# EAGLE design controller16 (EAGLE 9.4.2)

## Sheet 1 of 2
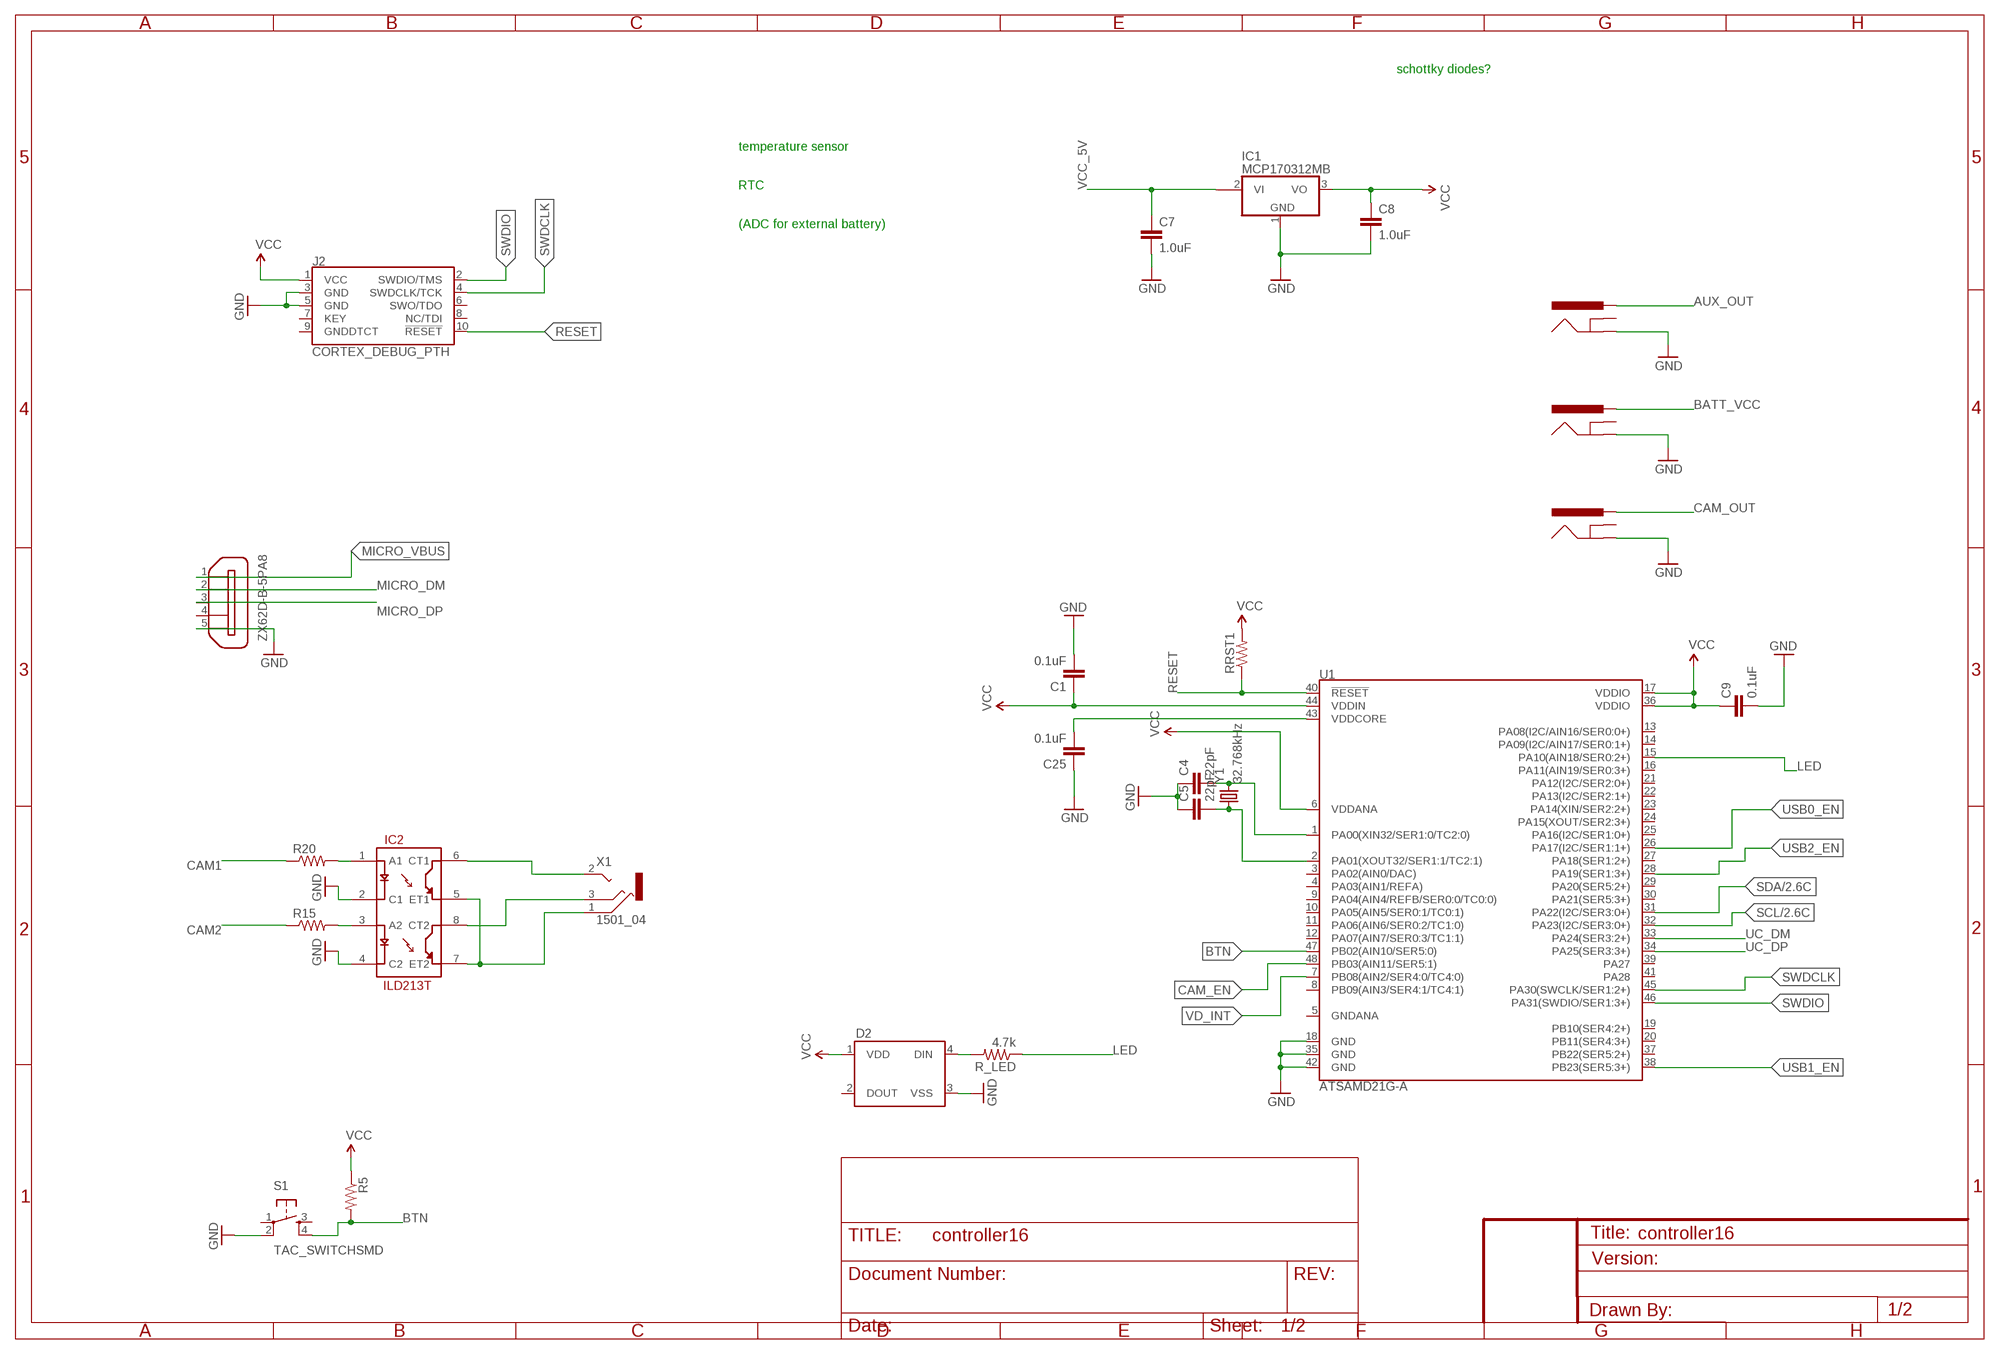
[diagram p0: schematic, sheet 1]

### Parts
C1  0.1uF  1.0UF-0805-25V-10%  [0805]
C4  22pF  CAP0805  [0805]
C5  22pF  CAP0805  [0805]
C7  1.0uF  1.0UF-1206-50V-10%  [1206]
C8  1.0uF  1.0UF-1206-50V-10%  [1206]
C9  0.1uF  1.0UF-0805-25V-10%  [0805]
C25  0.1uF  1.0UF-0805-25V-10%  [0805]
D2  WS2812B  [WS2812B]
IC1  MCP170312MB  [SOT89]
IC2  ILD213T  [SO08]
J1  POWER_JACKPTH_BREAD  [POWER_JACK_PTH_BREAD]
J2  CORTEX_DEBUG_PTH  [2X5-PTH-1.27MM]
J3  POWER_JACKPTH_BREAD  [POWER_JACK_PTH_BREAD]
J4  POWER_JACKPTH_BREAD  [POWER_JACK_PTH_BREAD]
R5  RESISTOR0805-RES  [0805]
R15  RESISTOR0805-RES  [0805]
R20  RESISTOR0805-RES  [0805]
R_LED  4.7k  RESISTOR0805-RES  [0805]
RRST1  RESISTOR0805-RES  [0805]
S1  TAC_SWITCHSMD  [TACTILE-SWITCH-SMD]
U1  ATSAMD21G-A  [TQFP-48]
X1  1501_04  [1501_05]
X2  ZX62D-B-5PA8  [ZX62D-B-5PA8]
Y1  32.768kHz  CRYSTAL3.2X1.5MM  [CRYSTAL-SMD-3.2X1.5MM]

### Nets
AUX_OUT [hub_power]: J1.PWR ; also sheet 2
BATT_VCC [hub_power]: J4.PWR ; also sheet 2
BTN: R5.2 S1.4 U1.47(PB02(AIN10/SER5:0))
CAM1: R20.1
CAM2: R15.1
CAM_EN: U1.48(PB03(AIN11/SER5:1)) ; also sheet 2
CAM_OUT: J3.PWR ; also sheet 2
GND: C1.2 C4.1 C5.1 C7.2 C8.2 C9.2 C25.1 D2.3(VSS) IC1.1(GND) IC2.2(C1) IC2.4(C2) J1.GND J2.3(GND) J2.5(GND) J3.GND J4.GND S1.2 U1.18(GND) U1.35(GND) U1.42(GND) X2.5 ; also sheet 2
LED: R_LED.1 U1.15(PA10(AIN18/SER0:2+))
MICRO_DM: X2.2
MICRO_DP: X2.3
MICRO_VBUS: X2.1
N$5: C25.2 U1.43(VDDCORE)
N$7: D2.4(DIN) R_LED.2
N$8: C4.2 U1.1(PA00(XIN32/SER1:0/TC2:0)) Y1.P$2
N$12: IC2.6(CT1) X1.2
N$13: IC2.8(CT2) X1.3
N$15: IC2.3(A2) R15.2
N$19: IC2.1(A1) R20.2
N$32: C5.2 U1.2(PA01(XOUT32/SER1:1/TC2:1)) Y1.P$1
N$34: IC2.5(ET1) IC2.7(ET2) X1.1
RESET: J2.10(!RESET) RRST1.1 U1.40(!RESET!)
SCL: U1.32(PA23(I2C/SER3:0+)) ; also sheet 2
SDA: U1.31(PA22(I2C/SER3:0+)) ; also sheet 2
SWDCLK: J2.4(SWDCLK/TCK) U1.45(PA30(SWCLK/SER1:2+))
SWDIO: J2.2(SWDIO/TMS) U1.46(PA31(SWDIO/SER1:3+))
UC_DM: U1.33(PA24(SER3:2+))
UC_DP: U1.34(PA25(SER3:3+))
USB0_EN: U1.26(PA17(I2C/SER1:1+))
USB1_EN: U1.38(PB23(SER5:3+))
USB2_EN: U1.28(PA19(SER1:3+))
VCC [power]: C1.1 C8.1 C9.1 D2.1(VDD) IC1.3(VO) J2.1(VCC) R5.1 RRST1.2 U1.6(VDDANA) U1.17(VDDIO) U1.36(VDDIO) U1.44(VDDIN) ; also sheet 2
VCC_5V [power]: C7.1 IC1.2@1(VI1)
VD_INT: U1.7(PB08(AIN2/SER4:0/TC4:0)) ; also sheet 2
Unconnected: D2.2(DOUT) IC1.2(VI) J1.GNDBREAK J2.6(SWO/TDO) J2.7(KEY) J2.8(NC/TDI) J2.9(GNDDTCT) J3.GNDBREAK J4.GNDBREAK S1.1 S1.3 U1.3(PA02(AIN0/DAC)) U1.4(PA03(AIN1/REFA)) U1.5(GNDANA) U1.8(PB09(AIN3/SER4:1/TC4:1)) U1.9(PA04(AIN4/REFB/SER0:0/TC0:0)) U1.10(PA05(AIN5/SER0:1/TC0:1)) U1.11(PA06(AIN6/SER0:2/TC1:0)) U1.12(PA07(AIN7/SER0:3/TC1:1)) U1.13(PA08(I2C/AIN16/SER0:0+)) U1.14(PA09(I2C/AIN17/SER0:1+)) U1.16(PA11(AIN19/SER0:3+)) U1.19(PB10(SER4:2+)) U1.20(PB11(SER4:3+)) U1.21(PA12(I2C/SER2:0+)) U1.22(PA13(I2C/SER2:1+)) U1.23(PA14(XIN/SER2:2+)) U1.24(PA15(XOUT/SER2:3+)) U1.25(PA16(I2C/SER1:0+)) U1.27(PA18(SER1:2+)) U1.29(PA20(SER5:2+)) U1.30(PA21(SER5:3+)) U1.37(PB22(SER5:2+)) U1.39(PA27) U1.41(PA28) X2.4 X2.S1 X2.S2 X2.S3 X2.S4

### Notes on the sheet
- schottky diodes?
- temperature sensor
- RTC
- (ADC for external battery)

## Sheet 2 of 2
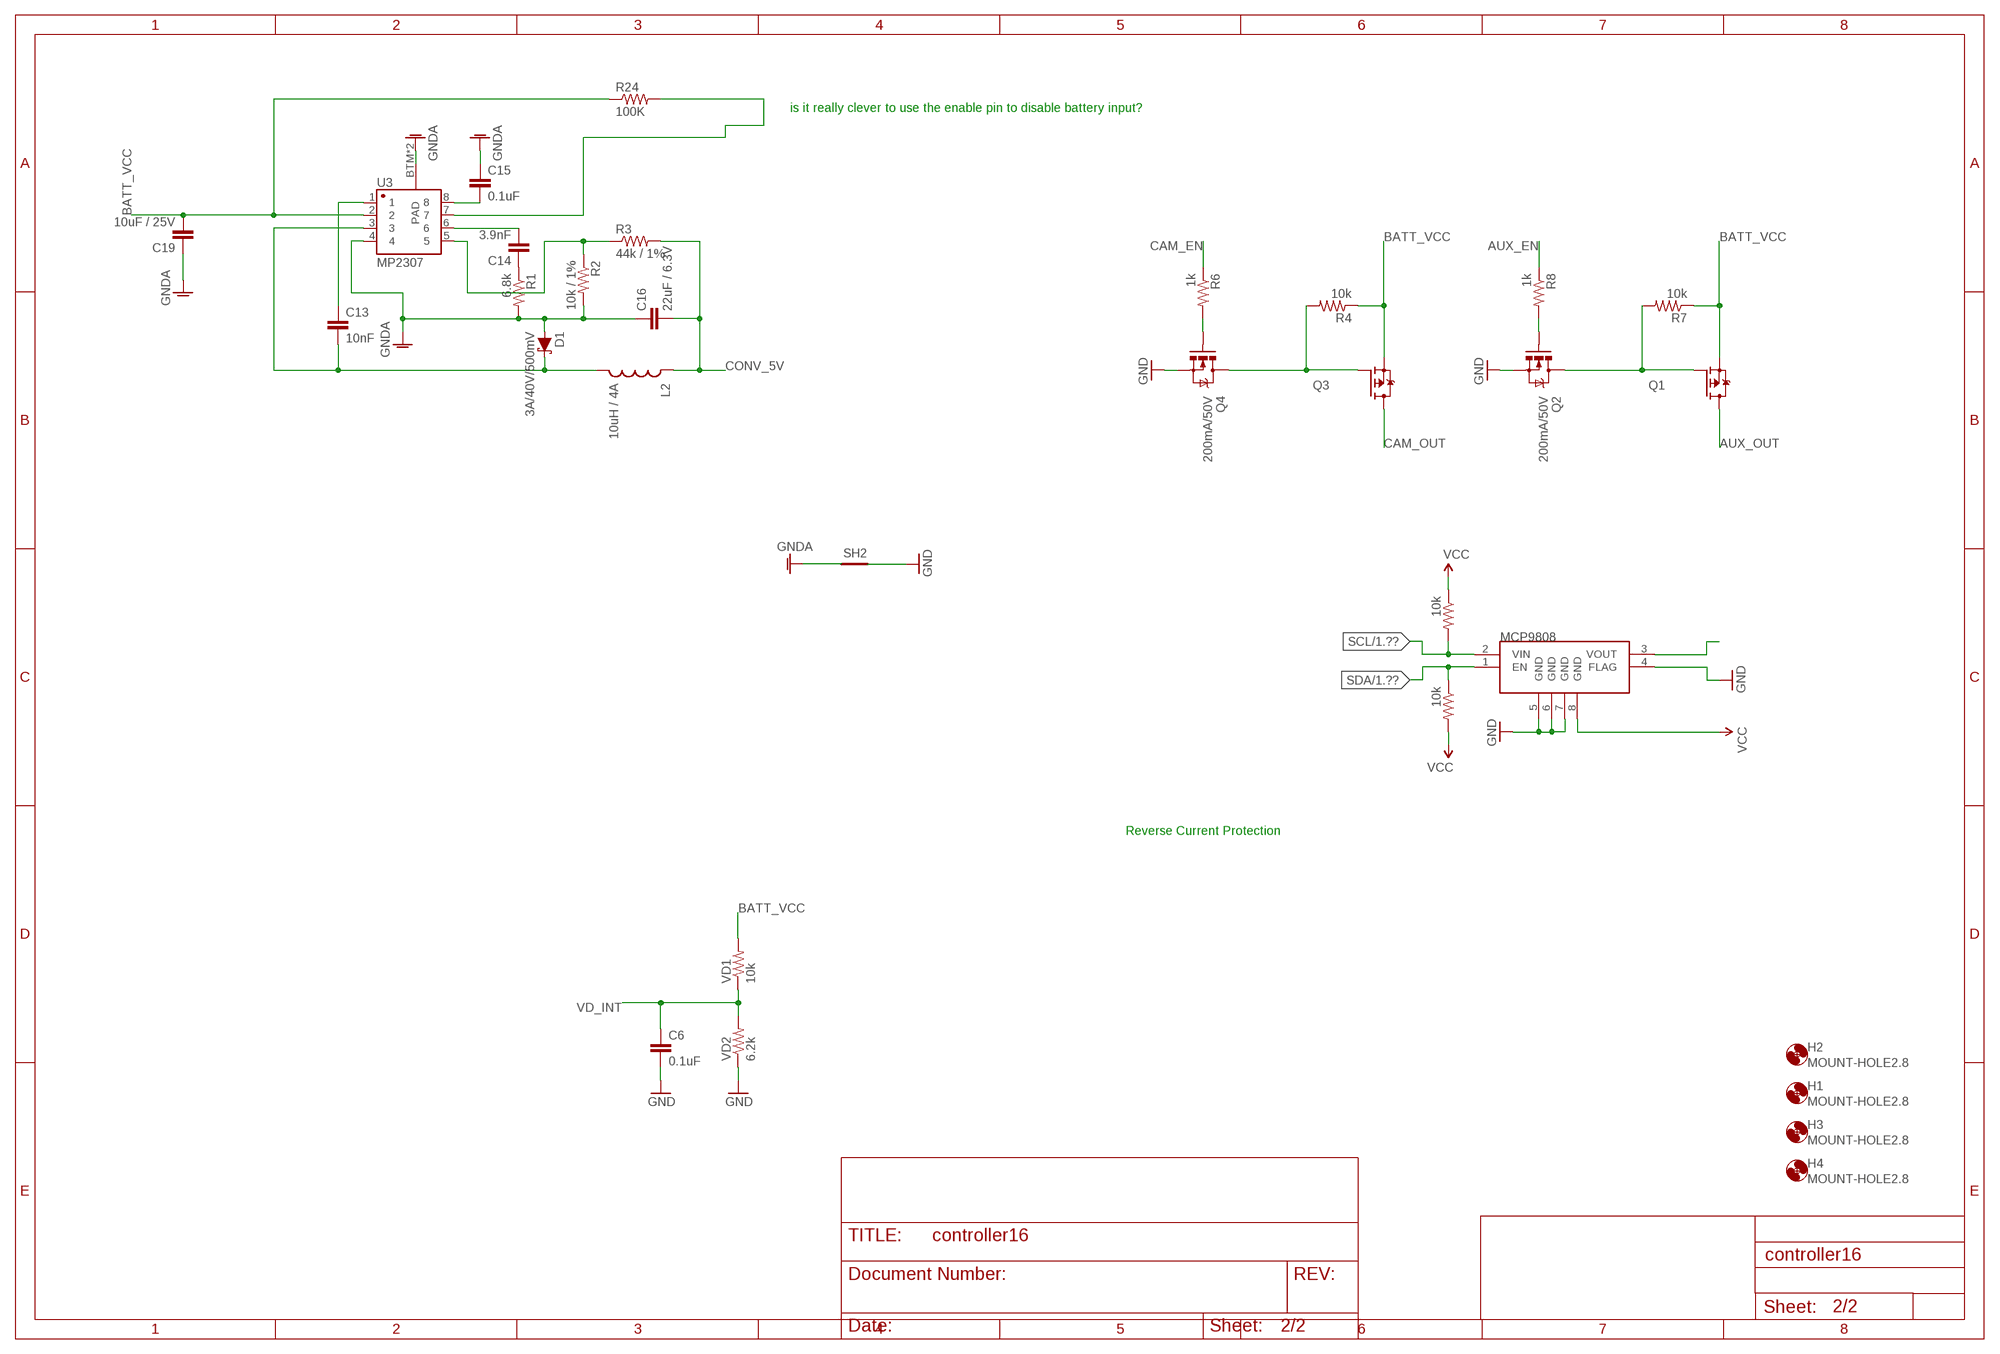
[diagram p1: schematic, sheet 2]

### Parts
C6  0.1uF  CAP1206  [1206]
C13  10nF  CAP0805  [0805]
C14  3.9nF  CAP1206  [1206]
C15  0.1uF  CAP1206  [1206]
C16  22uF / 6.3V  CAP1210  [1210]
C19  10uF / 25V  CAP1210  [1210]
D1  3A/40V/500mV  DIODE-SCHOTTKY-B340A  [SMA-DIODE]
H1  MOUNT-HOLE2.8  [2,8]
H2  MOUNT-HOLE2.8  [2,8]
H3  MOUNT-HOLE2.8  [2,8]
H4  MOUNT-HOLE2.8  [2,8]
L2  10uH / 4A  INDUCTORSRU1038  [SRU1038]
MCP9808  V_REG_MIC5216  [MSOP8]
Q1  FDD4141TO252  [TO252]
Q2  200mA/50V  MOSFET-NCHANNELBSS138  [SOT23-3]
Q3  FDD4141TO252  [TO252]
Q4  200mA/50V  MOSFET-NCHANNELBSS138  [SOT23-3]
R1  6.8k  RESISTOR1206  [1206]
R2  10k / 1%  RESISTOR1206  [1206]
R3  44k / 1%  RESISTOR1206  [1206]
R4  10k  RESISTOR0805-RES  [0805]
R6  1k  RESISTOR0805-RES  [0805]
R7  10k  RESISTOR0805-RES  [0805]
R8  1k  RESISTOR0805-RES  [0805]
R24  100K  RESISTOR1206  [1206]
R_I2C_1  10k  RESISTOR0805-RES  [0805]
R_I2C_2  10k  RESISTOR0805-RES  [0805]
SH2  SHORT-HT5  [SHORT_TOP-50]
U3  MP2307  GENERIC-SOIC8MSGEQ7N-FILTER  [SO08]
VD1  10k  RESISTOR1206  [1206]
VD2  6.2k  RESISTOR1206  [1206]

### Nets
AUX_EN: R8.1
AUX_OUT [hub_power]: Q1.3(D) ; also sheet 1
BATT_VCC [hub_power]: C19.2 Q1.2(S) Q3.2(S) R4.1 R7.1 R24.1 U3.2 VD1.2 ; also sheet 1
CAM_EN: R6.1 ; also sheet 1
CAM_OUT: Q3.3(D) ; also sheet 1
CONV_5V [power]: C16.2 L2.1 R3.2
GND: C6.2 MCP9808.4(FLAG) MCP9808.5(GND) MCP9808.6(GND) MCP9808.7(GND) Q2.2(S) Q4.2(S) SH2.2 VD2.1 ; also sheet 1
GNDA [power]: C15.1 C16.1 C19.1 D1.A R1.2 R2.2 SH2.1 U3.4 U3.BTM(PAD) U3.P$1(PAD)
N$1: Q1.1(G) Q2.3(D) R7.2
N$2: Q4.1(G) R6.2
N$3: Q3.1(G) Q4.3(D) R4.2
N$4: MCP9808.3(VOUT)
N$6: Q2.1(G) R8.2
N$25: C15.2 U3.8
N$26 [power]: C13.2 D1.C L2.2 U3.3
N$27: C13.1 U3.1
N$28: C14.1 R1.1
N$29: C14.2 U3.6
N$30: R2.1 R3.1 U3.5
PB_BUCK_EN: R24.2 U3.7
SCL: MCP9808.2(VIN) R_I2C_1.2 ; also sheet 1
SDA: MCP9808.1(EN) R_I2C_2.1 ; also sheet 1
VCC [power]: MCP9808.8(GND) R_I2C_1.1 R_I2C_2.2 ; also sheet 1
VD_INT: C6.1 VD1.1 VD2.2 ; also sheet 1

### Notes on the sheet
- is it really clever to use the enable pin to disable battery input?
- Reverse Current Protection

## Library data of the parts
C1 C9 C25 = SparkFun-Capacitors:1.0UF: 1µF ceramic capacitors A capacitor is a passive two-terminal electrical component used to store electrical energy temporarily in an electric field.; PROD_ID: CAP-08064; VALUE: 1.0uF
C4 C5 = SparkFun-Passives:CAP: Capacitor Standard 0603 ceramic capacitor, and 0.1" leaded capacitor.
C6 C13-C16 C19 = SparkFun-Capacitors:CAP: Capacitor Standard 0603 ceramic capacitor, and 0.1" leaded capacitor.
C7 C8 = SparkFun-Capacitors:1.0UF: 1µF ceramic capacitors A capacitor is a passive two-terminal electrical component used to store electrical energy temporarily in an electric field.; PROD_ID: CAP-09822
D1 = SparkFun-DiscreteSemi:DIODE-SCHOTTKY: Schottky diode A Schottky diode is a semiconductor diode which has a low forward voltage drop and a very fast switching action.; PROD_ID: DIO-09886
D2 = SparkFun-LED:WS2812B: WS2812B - Intelligent control LED integrated light source Technical Specifications: Power Supply Voltage (VDD): 3.5 to 5.3 V Input Voltage (VI): -0.5 to VDD+0.5 V Operating Junction Temperature (Topt): -25°C to +80°C Storage Temperature Range (Tstg): -55°C to +150°C; PROD_ID: DIO-12503
H1-H4 = holes:MOUNT-HOLE: MOUNTING HOLE with drill center marker
IC1 = linear:MCP1703*: 250 mA, 16V, Low Quiescent Current LDO Regulator Source: http://ww1.microchip.com/downloads/en/DeviceDoc/22049b.pdf
IC2 = SparkFun-DiscreteSemi:ILD213T: Dual optoisolator.
J1 J3 J4 = SparkFun-Connectors:POWER_JACK: Power Jack Connector This is the standard 5.5mm barrel jack for power. The PTH is the most common, proven, reliable, footprint. The Slot footprint only works if the mill layer is transmitted to the PCB fab house so be warned. Here are the connectors we sell at SparkFun: DC Barrel Power Jack/Connector <https://www.sparkfun.com/products/119> (PRT-00119) DC Barrel Power Jack/Connector (SMD) <https://www.sparkfun.com/products/12748> (PRT-12748) DC Barrel Jack Adapter - Breadboard Compatible <https://www.sparkfun.com/products/10811> (PRT-10811) It is used on this SparkFun product (and many, many others): SparkFun RedBoard - Programmed with Arduino <https://www.sparkfun.com/products/12757> (DEV-12757) Also, if you need a mating power supply or connector, please check these out: Wall Adapter Power Supply - 9VDC 650mA <https://www.sparkfun.com/products/298> (TOL-00298) DC Barrel Jack Adapter - Male <https://www.sparkfun.com/products/10287> (PRT-10287); PROD_ID: PRT-10811
J2 = SparkFun-Connectors:CORTEX_DEBUG: Cortex Debug Connector - 10 pin Supports JTAG debug, Serial Wire debug, and Serial Wire Viewer. PTH and SMD connector options available. General Connector Information <http://infocenter.arm.com/help/topic/com.arm.doc.faqs/attached/13634/cortex_debug_connectors.pdf> Products: PTH Connector <http://www.digikey.com/product-detail/en/cnc-tech/3220-10-0100-00/1175-1627-ND/3883661> -via Digi-Key SparkFun PSoc <https://www.sparkfun.com/products/13229> SparkFun T <https://www.sparkfun.com/products/13810>
L2 = SparkFun-Passives:INDUCTOR: Inductors Basic Inductor/Choke - 0603 and 1206. Footprints are not proven and vary greatly between part numbers. INDUCTOR POWER 3.3UH 4.0A SMD 0.197" L x 0.197" W x 0.177" H (5.00mm x 5.00mm x 4.50mm)
MCP9808 = SparkFun-IC-Power:V_REG_MIC5216: 500mA LDO, MSOP8 for better dissipation; PROD_ID: IC-09527
Q1 Q3 = transistor-fet:FDD4141: P-Channel PowerTrench® MOSFET Source: FDD4141.pdf
Q2 Q4 = SparkFun-DiscreteSemi:MOSFET-NCHANNEL: Common NMOSFET Parts MFG P/N Store ID Prod ID FDD8780 TRANS-09984 SI7820DN TRANS-11055 FDS6630A IC-08089 2N7002PW TRANS-11151 FQP30N06L COM-10213 TRANS-10060 BSS123LT1G TRANS-08345 BSS138 TRANS-00830 BS170 2N7000; PROD_ID: TRANS-00830
R1-R4 R6-R8 R24 R_LED = SparkFun-Resistors:RESISTOR: Resistor Basic schematic elements and footprints for 0603, 1206, and PTH resistors.
R5 R15 R20 R_I2C_1 R_I2C_2 RRST1 VD1 VD2 = SparkFun-Passives:RESISTOR: Resistor Basic schematic elements and footprints for 0603, 1206, and PTH resistors.
S1 = SparkFun-Retired:TAC_SWITCH: Momentary Switch Button commonly used for reset or general input. Spark Fun Electronics SKU : COM-00097 SMT- SWCH-08247; PROD_ID: SWCH-08247
SH2 = shorts:SHORT-H: Short between two nets; BOM: no
U1 = SparkFun-IC-Microcontroller:ATSAMD21G: Atmel SAMD21G SMART ARM-Based Microcontroller The Atmel ® | SMART ™ SAM D21 is a series of low-power microcontrollers using the 32-bit ARM ® Cortex ® -M0+ processor, and ranging from 32- to 64-pins with up to 256KB Flash and 32KB of SRAM. The SAM D21 devices operate at a maximum frequency of 48MHz and reach 2.46 CoreMark/MHz. They are designed for simple and intuitive migration with identical peripheral modules, hex compatible code, identical linear address map and pin compatible migration paths between all devices in the product series. All devices include intelligent and flexible peripherals, Atmel Event System for inter-peripheral signaling, and support for capacitive touch button, slider and wheel user interfaces. Datasheet <https://cdn.sparkfun.com/datasheets/Dev/Arduino/Boards/Atmel-42181-SAM-D21_Datasheet.pdf> SparkFun Products SparkFun SAMD21 Mini Breakout <https://www.sparkfun.com/products/13664> (DEV-13664) SparkFun SAMD21 Dev Breakout <https://www.sparkfun.com/products/13672> (DEV-13672); PROD_ID: IC-13064
U3 = SparkFun-AnalogIC:GENERIC-SOIC8: A placeholder for generic narrow & wide SOIC8 foorptints - used on the DIP adapter board.; PROD_ID: IC-10141
X1 = con-lumberg:1501_0*: Jack connectors according to JISC 6560, 2.5 mm Klinkensteckverbinder nach JISC 6560, 2,5 mm Source: http://www.lumberg.com/Produkte/PDFs/1501_05.pdfedit 1501_03 http://www.lumberg.com/Produkte/PDFs/1501_06.pdf; OC_FARNELL: 1216977; OC_NEWARK: unknown
X2 = zx62d-b-5pa8-oshpark_10:ZX62D-B-5PA8: Micro USB Type B Connector - Standard, Shell Through Hole Source: http://www.hirose.co.jp/cataloge_hp/ed_ZX_20140804.pdf; MF: Hirose; MPN: ZX62D-B-5PA8; OC_FARNELL: 2300438; OC_NEWARK: 69W0712
Y1 = SparkFun-FreqCtrl:CRYSTAL: Various standard crystals. Proven footprints.; PROD_ID: XTAL-13062

## Net classes
0 default: width 0.254 mm, clearance 0.152 mm
1 power: width 0.254 mm, clearance 0.254 mm
2 hub_power: width 0.584 mm, clearance 0.254 mm
3 usbsignal: width 0.254 mm, clearance 0.203 mm
4 highpower: clearance 0.305 mm

## Board
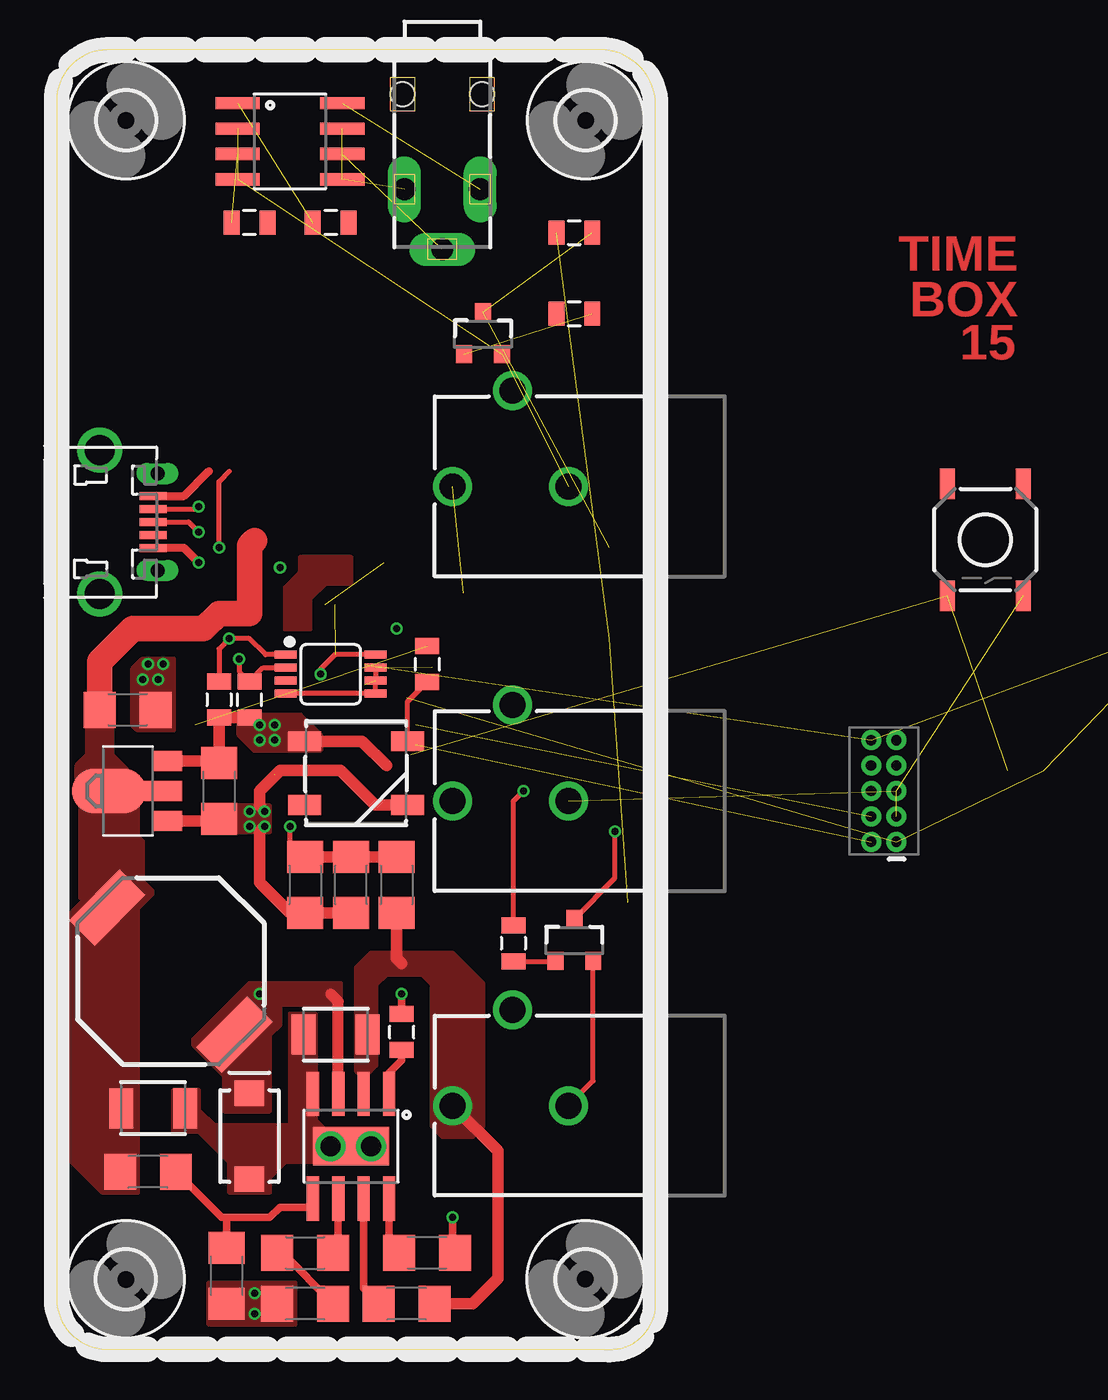
[diagram p2: board, top side]
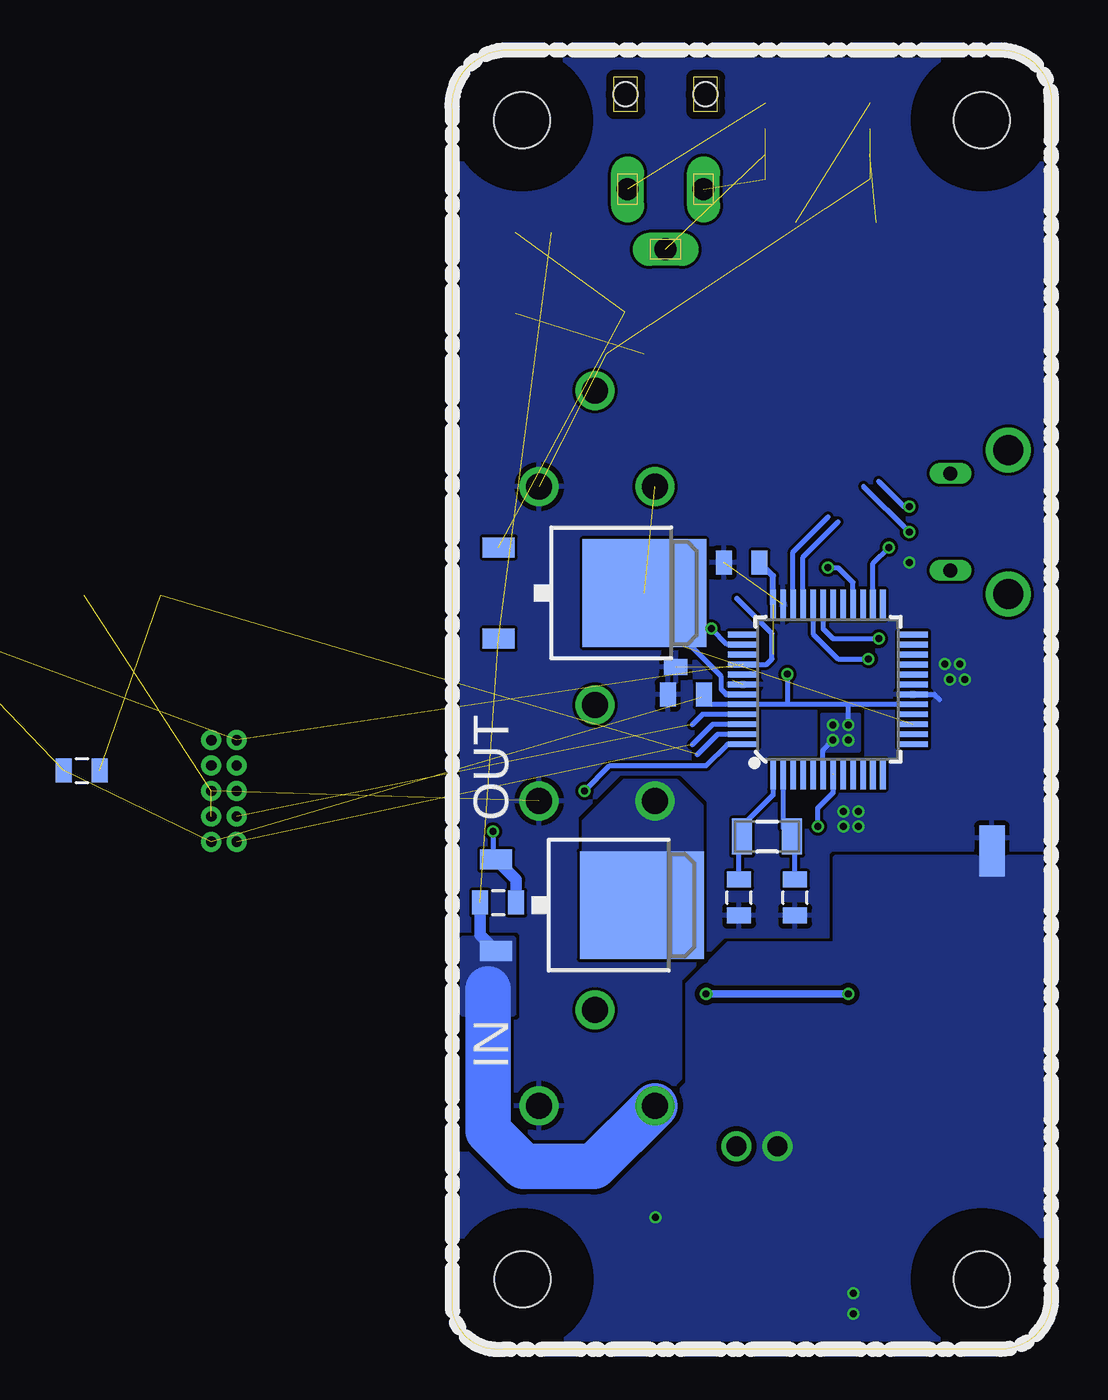
[diagram p3: board, bottom side, seen from below]

Size 29.98 x 65.04 mm. Coordinates in mm from the lower left corner, seen from the top.
Outline: 0,2.55 arc90 2.54,0.01 27.43,0.01 arc90 29.97,2.05 29.97,61.99 arc90 27.43,65.04 2.54,65.04 arc90 0,62.5 0,2.55
Copper layers (1*16): Top 0.035559375mm / dielectric 1.6mm / Bottom 0.035559375mm
Design rules "oshpark-2layer": minimum track width 6mil, minimum drill 10mil, track to track 6mil, track to pad 6mil, pad to pad 6mil, via to via 6mil, smd to smd 6mil, copper to edge 15mil, drill to drill 6mil, minimum pad ring 5mil, minimum via ring 5mil, stop-mask expansion 2.5mil, vias tented up to drill 0mil, thermal gap 10mil

### Footprints (pad centres in the part's own frame; a part is rotated, then mirrored left to right if it is on the bottom)
0805 = smd 0.8 x 1.2: 1 -0.9,0; 2 0.9,0
1206 = smd 1.6 x 1.8: 1 -1.4,0; 2 1.4,0
1210 = smd 1.2 x 2: 1 -1.6,0; 2 1.6,0
SMA-DIODE = smd 1.27 x 1.47: A -2.15,0; C 2.15,0
WS2812B = smd 1.651 x 1: 1 -2.577,1.6; 2 -2.577,-1.6; 3 2.577,-1.6; 4 2.577,1.6
2,8 = hole 2.8: 0,0
SOT89 = smd 1 x 1.5: 1 -1.499,-1.981; 3 1.499,-1.981 | smd 1 x 2: 2 0,-1.727 | smd 2.2 x 3.7: 2@1 0,0.94
SO08 = smd 0.61 x 2.21: 1 -1.905,-2.616; 2 -0.635,-2.616; 3 0.635,-2.616; 4 1.905,-2.616; 5 1.905,2.616; 6 0.635,2.616; 7 -0.635,2.616; 8 -1.905,2.616
POWER_JACK_PTH_BREAD = drill 1.3: GND 0,7.9; GNDBREAK 4.8,10.7; PWR 0,13.7
2X5-PTH-1.27MM = drill 0.508 pad 1: 1 -2.54,-0.635; 2 -2.54,0.635; 3 -1.27,-0.635; 4 -1.27,0.635; 5 0,-0.635; 6 0,0.635; 7 1.27,-0.635; 8 1.27,0.635; 9 2.54,-0.635; 10 2.54,0.635
SRU1038 = smd 1.8 x 3.6: 1 -4.5,0; 2 4.5,0
MSOP8 = smd 0.4 x 1.1: 1 -0.975,-2.25; 2 -0.325,-2.25; 3 0.325,-2.25; 4 0.975,-2.25; 5 0.975,2.25; 6 0.325,2.25; 7 -0.325,2.25; 8 -0.975,2.25
TO252 = smd 1 x 1.6: 1 -2.28,-4.8; 2 2.28,-4.8 | smd 5.4 x 6.2: 3 0,2.5
SOT23-3 = smd 0.8 x 0.9: 1 -0.95,-1; 2 0.95,-1; 3 0,1.1
TACTILE-SWITCH-SMD = smd 1.524 x 0.762: 1 -2.794,1.905; 2 2.794,1.905; 3 -2.794,-1.905; 4 2.794,-1.905
SHORT_TOP-50 = smd 1.27 x 1.27: 1 0.635,0; 2 -0.635,0
TQFP-48 = smd 1.5 x 0.28: 1 -4.25,2.75; 2 -4.25,2.25; 3 -4.25,1.75; 4 -4.25,1.25; 5 -4.25,0.75; 6 -4.25,0.25; 7 -4.25,-0.25; 8 -4.25,-0.75; 9 -4.25,-1.25; 10 -4.25,-1.75; 11 -4.25,-2.25; 12 -4.25,-2.75; 25 4.25,-2.75; 26 4.25,-2.25; 27 4.25,-1.75; 28 4.25,-1.25; 29 4.25,-0.75; 30 4.25,-0.25; 31 4.25,0.25; 32 4.25,0.75; 33 4.25,1.25; 34 4.25,1.75; 35 4.25,2.25; 36 4.25,2.75 | smd 0.28 x 1.5: 13 -2.75,-4.25; 14 -2.25,-4.25; 15 -1.75,-4.25; 16 -1.25,-4.25; 17 -0.75,-4.25; 18 -0.25,-4.25; 19 0.25,-4.25; 20 0.75,-4.25; 21 1.25,-4.25; 22 1.75,-4.25; 23 2.25,-4.25; 24 2.75,-4.25; 37 2.75,4.25; 38 2.25,4.25; 39 1.75,4.25; 40 1.25,4.25; 41 0.75,4.25; 42 0.25,4.25; 43 -0.25,4.25; 44 -0.75,4.25; 45 -1.25,4.25; 46 -1.75,4.25; 47 -2.25,4.25; 48 -2.75,4.25
SO08' = smd 0.61 x 2.21: 1 -1.905,-2.616; 2 -0.635,-2.616; 3 0.635,-2.616; 4 1.905,-2.616; 5 1.905,2.616; 6 0.635,2.616; 7 -0.635,2.616; 8 -1.905,2.616 | smd 3.81 x 1.93: BTM 0,0 | drill 1: P$1 1.016,0; P$2 -1.016,0
1501_05 = drill 1.1 pad 1.4 long: 1 -1.9,-8.5; 2 0,-11.5; 3 1.9,-8.5 | hole 1.2: -2,-3.75; 2,-3.75
ZX62D-B-5PA8 = smd 1.35 x 0.4: 1 4.825,1.3; 2 4.825,0.65; 3 4.825,0; 4 4.825,-0.65; 5 4.825,-1.3 | drill 1.5: S1 2.15,-3.6; S2 2.15,3.6 | drill 0.7 long: S3 5.05,2.425; S4 5.05,-2.425
CRYSTAL-SMD-3.2X1.5MM = smd 1 x 1.8: P$1 -1.25,0; P$2 1.25,0

### Placement (x,y rotation side)
C1  18.29,32.78 180 bottom
C4  15.62,22.62 90 bottom
C5  12.83,22.62 90 bottom
C6  12.45,23.25 270 top
C7  3.56,32.02 0 top
C8  8.13,27.95 270 top
C9  15.49,39.38 180 bottom
C13  17.27,15.89 90 top
C14  12.45,4.84 0 top
C15  18.54,4.84 180 top
C16  4.83,12.08 180 top
C19  13.97,15.76 0 top
C25  18.8,35.07 90 bottom
D1  9.65,10.68 90 top
D2  14.99,28.84 0 top
H1  26.47,3.52 0 top
H2  26.48,61.52 0 top
H3  3.47,3.51 0 top
H4  3.47,61.51 0 top
IC1  3.56,27.95 90 top
IC2  11.68,60.47 270 top
J1  33.53,43.19 90 top
J2  41.4,27.95 90 top  (outside the outline)
J3  33.53,27.45 90 top
J4  33.53,12.21 90 top
L2  5.71,18.94 315 top
MCP9808  13.72,33.8 270 top
Q1  22.86,37.86 270 bottom
Q2  21.34,50.81 0 top
Q3  22.99,22.24 270 bottom
Q4  25.91,20.46 0 top
R1  12.45,2.3 180 top
R2  8.51,3.7 270 top
R3  4.57,8.9 180 top
R4  27.69,22.37 0 bottom
R5  48.51,28.97 0 bottom  (outside the outline)
R6  22.86,20.33 270 top
R7  25.91,55.89 0 top
R8  25.91,51.83 0 top
R15  9.65,56.4 180 top
R20  13.72,56.4 180 top
R24  17.53,2.3 180 top
R_I2C_1  9.65,32.53 90 top
R_I2C_2  8.13,32.53 270 top
R_LED  18.54,34.3 270 top
RRST1  54.61,35.32 180 bottom  (outside the outline)
S1  46.48,40.53 270 top  (outside the outline)
SH2  2.97,24.96 270 bottom
U1  11.18,33.03 90 bottom
U3  MP2307  [SO08']  14.73,10.17 180 top
VD1  17.02,23.25 270 top
VD2  14.73,23.25 90 top
X1  19.3,66.56 0 top
X2  0,41.42 0 top
Y1  14.22,25.67 180 bottom

### Tracks (layer width: path | path; a pad name or v marks a point on that pad's centre or on a via)
AUX_OUT  (1 unrouted)
BATT_VCC  (2 unrouted)
  Top 0.584: R24.1 20.83,2.3 22.1,3.57 22.1,9.94 J4.PWR | VD1.2 17.02,19.57 17.27,19.32
  Bottom 0.584: R4.1 28.59,20.76 Q3.2
  Bottom 2.286: J4.PWR 22.88,9.16 26.42,9.16 28.19,10.94 28.19,18.05
  pour Top (no thermals): 18.8,11.19 19.3,10.68 20.83,10.68 21.34,11.19 21.34,18.3 19.81,19.83 15.75,19.83 14.99,19.06 14.99,13.98 15.24,13.73 15.24,11.95 15.49,11.95 15.49,13.73 16,14.24 16,18.3 16.51,18.81 18.29,18.81 18.8,18.3
  pour Bottom (no thermals): 26.92,20.59 26.92,16.78 29.46,16.78 29.46,20.59
BTN  (2 unrouted)
  Bottom 0.254: U1.47 16.7,30.78 17.71,29.77 | 47.75,28.83 R5.2
CAM_EN  (via drill 0.35)
  Top 0.254: R6.1 22.86,27.45 v23.37,27.95
  Bottom 0.254: v23.37,27.95 22.1,29.22 17.27,29.22 16.21,30.28 U1.48
CAM_OUT
  pour Bottom (no thermals): 23.37,24.91 23.37,26.43 21.34,28.46 18.8,28.46 17.53,27.19 17.53,24.65 23.37,24.65
CONV_5V
  pour Top (no thermals): 3.3,24.4 0.76,21.86 0.76,9.41 2.29,7.89 4.06,7.89 4.06,22.11 4.83,22.87
GND  (via drill 0.35)  (9 unrouted)
  Top 0.254: J4.GND 26.86,13.44 Q4.2 | MCP9808.7 MCP9808.6 MCP9808.5 MCP9808.4 | 5.46,32.53 C7.2
  Top 0.406: X2.5 6.38,40.12 v7.11,39.38
  Top 0.584: VD2.1 C6.2 11.69,21.85 10.16,23.38 10.16,25.92 v10.41,26.18 | IC1.1 8.03,26.45 C8.2 | D2.3 15.95,27.24 14.22,28.97 11.18,28.97 10.16,27.95 10.16,27.19 v10.41,26.94
  Bottom 0.254: U1.18 5.85,32.78 5.59,32.53
  other vias: 4.32,33.54 5.08,33.54 4.57,34.3 5.33,34.3 9.65,26.94 9.65,26.18
  pour Bottom (rank 6): 29.84,0.01 0,0.01 0,65.04 17.56,65.18 29.84,65.04
  pour Top (no thermals): 5.84,31 4.06,31 3.81,31.26 3.81,33.8 3.81,34.05 4.32,34.56 5.84,34.56
  pour Top (no thermals): 7.37,27.19 7.37,25.92 10.67,25.92 10.67,27.19
GNDA  (via drill 0.35)
  Top 0.381: C15.1 19.81,4.97 v19.81,6.62
  other vias: 9.91,2.81 9.91,1.79
  pour Bottom (no thermals): 0,24.65 0,-0.11 12.57,-0.11 29.9,-0.54 29.9,9.79 21.72,9.79 18.19,13.32 18.19,13.37 18.19,18.28 16.13,20.33 10.79,20.33 10.79,24.65
  pour Top (no thermals): 11.94,3.32 7.62,3.32 7.62,1.28 11.94,1.28
  pour Top (no thermals): 12.95,16.78 11.68,16.78 11.68,11.19 7.87,11.19 7.11,11.95 7.11,12.97 5.84,12.97 5.84,10.94 7.11,10.94 8.64,9.41 8.64,7.89 10.67,7.89 10.67,8.65 11.43,9.41 16.51,9.41 16.51,10.94 13.46,10.94 12.95,11.44 12.95,11.95
LED  (1 unrouted)
MICRO_DM  (via drill 0.35)
  Top 0.254: X2.2 7,42.07 v7.11,42.18
  Bottom 0.254: v7.11,42.18 7.37,42.18 8.64,43.45
MICRO_DP  (via drill 0.35)
  Top 0.254: X2.3 6.6,41.42 v7.11,40.91
  Bottom 0.254: v7.11,40.91 9.4,43.19
MICRO_VBUS
  Top 0.406: X2.1 6.38,42.72 7.62,43.96
N$1  (2 unrouted)
N$2
  Top 0.254: R6.2 24.93,19.43 Q4.1
N$3  (via drill 0.35)
  Top 0.254: Q4.3 27.94,23.59 v27.94,25.92
  Bottom 0.254: v27.94,25.92 27.94,24.67 Q3.1
  Bottom 0.584: R4.2 26.79,23.52 Q3.1
N$5
  Bottom 0.254: 16.26,32.78 16.51,33.03 16.51,33.68 C25.2
  Bottom 0.305: U1.43 16.26,32.78
N$6  (1 unrouted)
N$7
  Top 0.254: 18.51,33.37 R_LED.2 17.56,32.42 D2.4
N$8
  Bottom 0.254: U1.1 13.93,27.74 15.47,26.2 Y1.P$2 15.62,25.52 C4.2
N$12  (1 unrouted)
N$13  (1 unrouted)
N$15  (1 unrouted)
N$19  (1 unrouted)
N$25
  Top 0.381: C15.2 16.64,5.34 U3.8
N$26  (via drill 0.35)
  Top 0.381: C13.2 v17.27,17.79
  Top 0.559: U3.3 14.1,17.41 13.72,17.79
  Bottom 0.381: v17.27,17.79 v10.16,17.79
  pour Top (no thermals): 6.86,15.25 8.38,13.73 8.38,11.95 10.67,11.95 10.67,15.76 11.18,16.27 11.18,17.29 14.22,17.29 14.22,18.3 9.65,18.3 6.86,15.51
N$27
  Top 0.381: U3.1 16.64,13.85 17.27,14.48 C13.1
N$28
  Top 0.381: R1.1 11.31,4.84 C14.1
N$29
  Top 0.381: U3.6 14.1,5.09 C14.2
N$30
  Top 0.381: U3.5 12.7,7.43 12.7,7.13 11.18,7.13 10.67,6.62 8.64,6.62 | R3.1 8.26,6.62 8.64,6.62 | R2.1 8.51,6.49 8.64,6.62
N$32
  Bottom 0.254: U1.2 13.43,26.12 Y1.P$1 12.83,25.52 C5.2
N$34  (2 unrouted)
PB_BUCK_EN
  Top 0.381: R24.2 15.37,3.06 U3.7
RESET  (2 unrouted)
  Bottom 0.254: U1.40 14.24,34.28 13.97,34.56 13.97,35.83 15.75,37.61
SCL  (via drill 0.35)
  Top 0.254: R_I2C_1.2 9.14,33.93 v9.14,34.56 | 11.39,34.05 MCP9808.2 10.35,34.12 R_I2C_1.2 | 9.65,33.54 R_I2C_1.2
  Bottom 0.254: U1.32 11.93,35.82 10.67,34.56 v9.14,34.56
SDA  (via drill 0.35)
  Top 0.254: R_I2C_2.1 8.13,35.07 v8.64,35.57 9.65,35.57 10.45,34.77 MCP9808.1
  Bottom 0.254: U1.31 11.43,36.08 10.92,35.57 v8.64,35.57
SWDCLK  (1 unrouted)
  Bottom 0.254: U1.45 17.46,31.78 17.97,31.28
SWDIO  (1 unrouted)
  Bottom 0.254: U1.46 16.95,31.28 17.97,30.27
UC_DM
  Bottom 0.254: U1.33 12.43,39.66 10.67,41.42
UC_DP
  Bottom 0.254: U1.34 12.93,39.92 11.18,41.67
USB0_EN  (via drill 0.35)
  Top 0.254: v8.13,40.15 8.13,43.45 8.64,43.96
  Bottom 0.254: U1.26 8.93,39.35 v8.13,40.15
USB1_EN  (via drill 0.35)
  Top 0.254: v17.02,36.08 16.88,36.22
  Bottom 0.254: U1.38 16.22,35.28 v17.02,36.08
USB2_EN  (via drill 0.35)
  Bottom 0.254: U1.28 9.93,38.39 10.67,39.13 v11.18,39.13
VCC  (via drill 0.35)  (4 unrouted)
  Top 0.254: MCP9808.8 13.93,34.77 13.21,34.05 v13.21,33.8
  Top 0.584: IC1.3 8.03,29.45 C8.1 R_I2C_2.2 R_I2C_1.1 | D2.1 15.29,30.44 16.51,29.22
  Bottom 0.254: 13.21,32.28 U1.44 17.07,32.28 17.47,32.68 | v13.21,33.8 13.21,32.28 | U1.17 10.16,32.28 | 10.16,32.28 13.21,32.28 | U1.6 11.43,29.99 v10.92,30.49 | v10.16,31.26 10.16,32.28
  Bottom 0.305: 17.51,32.63 17.47,32.68 C1.1 | U1.36 13.93,38.72 C9.1
  Bottom 0.584: 49.53,28.85 R5.1
  other vias: 10.16,30.49 10.92,31.26
  pour Top (no thermals): 13.21,29.99 9.91,29.99 9.14,30.75 9.14,31.76 12.19,31.76 13.21,30.75
  pour Bottom: 9.65,31.76 9.65,29.99 11.43,29.99 11.43,31.76
VCC_5V
  Top 1.27: C7.1 2.16,34.43 3.81,36.08 7.37,36.08 8.13,36.84 9.65,36.84 9.65,40.24 9.91,40.49
  pour Top (no thermals): 4.32,22.62 4.32,25.41 4.06,25.67 4.06,28.46 2.79,29.73 2.79,32.78 1.52,32.78 1.52,29.73 1.02,29.22 1.02,28.46 1.21,28.27 1.21,22.62
  pour Top (no thermals): 11.43,36.08 12.7,36.08 12.7,37.61 13.46,38.37 14.73,38.37 14.73,39.64 12.19,39.64 12.19,38.88 11.43,38.11
VD_INT  (via drill 0.35)  (1 unrouted)
  Top 0.254: C6.1 11.68,25.42 v11.68,26.18
  Top 0.584: VD1.1 VD2.2 C6.1
  Bottom 0.254: 10.9,28.78 10.9,27.88 11.68,27.1 v11.68,26.18

### Text on the board
Top: TIME | BOX | 15
bPlace: OUT | IN